# Altium schematic sheet 01_Block Diagram.SchDoc
size 297 x 209 mm
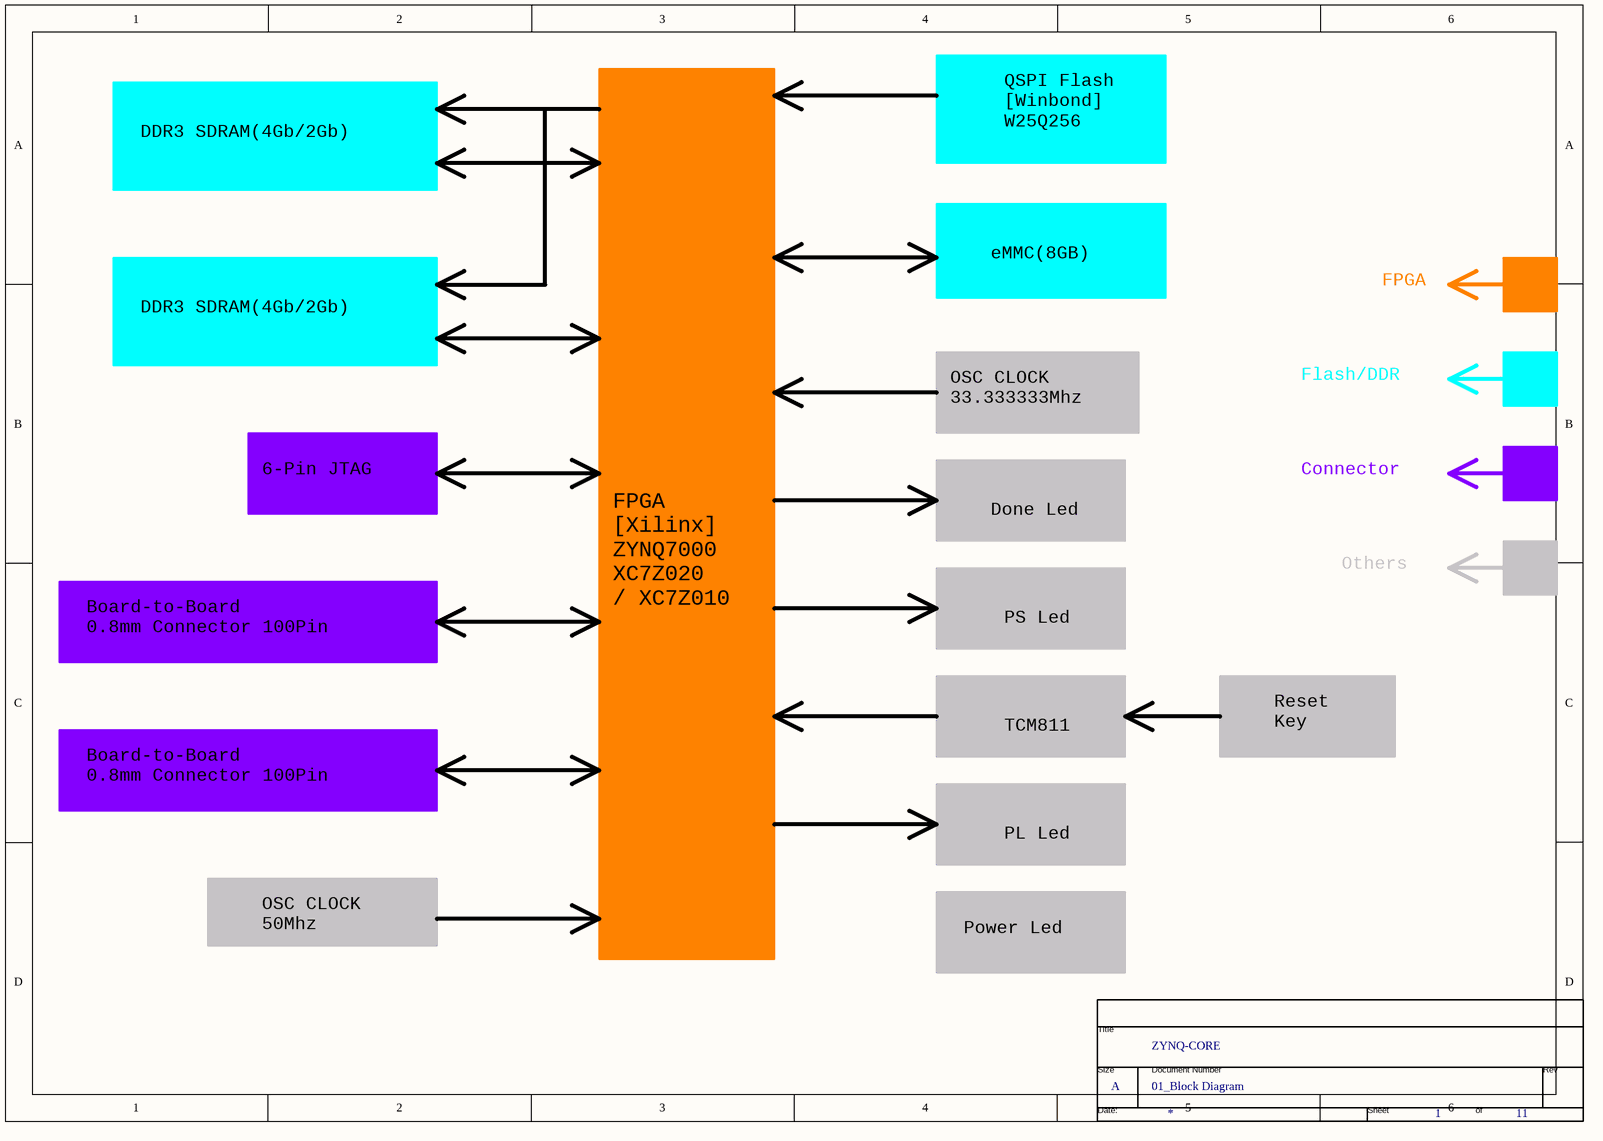
[diagram p0: 01_Block Diagram.SchDoc]

## Parts
*  Page Count: 11  Page Number: 1  Page Size: A  Title: ZYNQ-CORE  Doc: 01_Block Diagram  (hidden comment: TitleBlock0)  (graphical)

## Notes on the sheet
- DDR3 SDRAM(4Gb/2Gb)
- QSPI Flash
  [Winbond]
  W25Q256
- eMMC(8GB)
- FPGA
- Flash/DDR
- 6-Pin JTAG
- OSC CLOCK
  33.333333Mhz
- Connector
- Done Led
- Others
- Board-to-Board
  0.8mm Connector 100Pin
- FPGA
  [Xilinx]
  ZYNQ7000
  XC7Z020
  / XC7Z010
- PS Led
- TCM811
- Reset
  Key
- PL Led
- OSC CLOCK
  50Mhz
- Power Led
- (in symbol TitleBlock0) Title; Size; Document Number; Rev; Date:; Sheet; of

## Library data of the parts
* = TitleBlock0: Page Create Date: March  8, 1995; Page Modify Date: *